# Altium schematic sheet RPi_Pico.SchDoc: Raspberry Pi Pico
size A
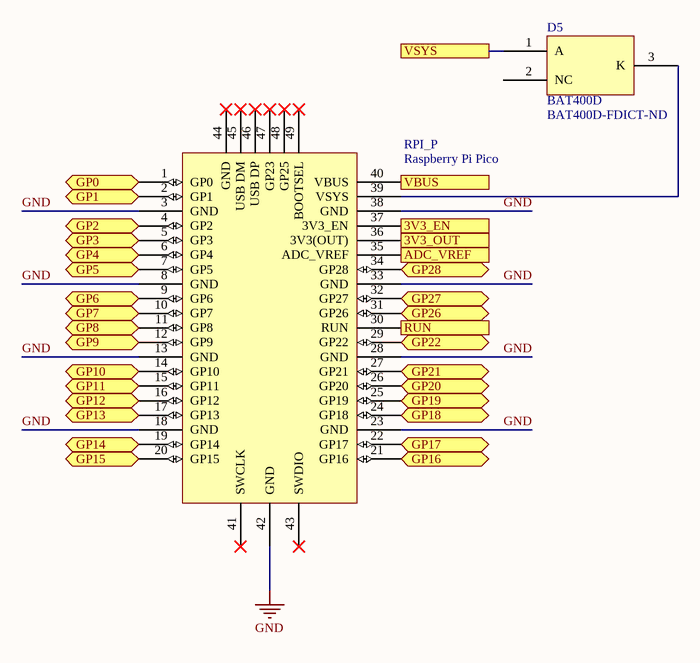
[diagram p0: RPi_Pico.SchDoc]

## Parts
D5  BAT400D  Supplier Part Number 1: BAT400D-FDICT-ND  [SOT95P236X110-3N]
RPI_P  Raspberry Pi Pico  [RPI_PICO]

## Ports
3V3_EN, 3V3_OUT, ADC_VREF (in), GP0 (bidir), GP1 (bidir), GP2 (bidir), GP3 (bidir), GP4 (bidir), GP5 (bidir), GP6 (bidir), GP7 (bidir), GP8 (bidir), GP9 (bidir), GP10 (bidir), GP11 (bidir), GP12 (bidir), GP13 (bidir), GP14 (bidir), GP15 (bidir), GP16 (bidir), GP17 (bidir), GP18 (bidir), GP19 (bidir), GP20 (bidir), GP21 (bidir), GP22 (bidir), GP26 (bidir), GP27 (bidir), GP28 (bidir), RUN (in), VBUS, VSYS

## Nets
GND: RPI_P.3(GND) RPI_P.8(GND) RPI_P.13(GND) RPI_P.18(GND) RPI_P.23(GND) RPI_P.28(GND) RPI_P.33(GND) RPI_P.38(GND) RPI_P.42(GND)
3V3_EN: RPI_P.37(3V3_EN) ; port 3V3_EN
3V3_OUT: RPI_P.36(3V3(OUT)) ; port 3V3_OUT
ADC_VREF: RPI_P.35(ADC_VREF) ; port ADC_VREF
GP0: RPI_P.1(GP0) ; port GP0
GP1: RPI_P.2(GP1) ; port GP1
GP2: RPI_P.4(GP2) ; port GP2
GP3: RPI_P.5(GP3) ; port GP3
GP4: RPI_P.6(GP4) ; port GP4
GP5: RPI_P.7(GP5) ; port GP5
GP6: RPI_P.9(GP6) ; port GP6
GP7: RPI_P.10(GP7) ; port GP7
GP8: RPI_P.11(GP8) ; port GP8
GP9: RPI_P.12(GP9) ; port GP9
GP10: RPI_P.14(GP10) ; port GP10
GP11: RPI_P.15(GP11) ; port GP11
GP12: RPI_P.16(GP12) ; port GP12
GP13: RPI_P.17(GP13) ; port GP13
GP14: RPI_P.19(GP14) ; port GP14
GP15: RPI_P.20(GP15) ; port GP15
GP16: RPI_P.21(GP16) ; port GP16
GP17: RPI_P.22(GP17) ; port GP17
GP18: RPI_P.24(GP18) ; port GP18
GP19: RPI_P.25(GP19) ; port GP19
GP20: RPI_P.26(GP20) ; port GP20
GP21: RPI_P.27(GP21) ; port GP21
GP22: RPI_P.29(GP22) ; port GP22
GP26: RPI_P.31(GP26) ; port GP26
GP27: RPI_P.32(GP27) ; port GP27
GP28: RPI_P.34(GP28) ; port GP28
RUN: RPI_P.30(RUN) ; port RUN
VBUS: RPI_P.40(VBUS) ; port VBUS
VSYS: D5.1(A) ; port VSYS
NetD5_3: D5.3(K) RPI_P.39(VSYS)

Not connected (* = marked no-connect by the designer): D5 2(NC); RPI_P 41(SWCLK)* 43(SWDIO)* 44(GND)* 45(USB_DM)* 46(USB_DP)* 47(GP23)* 48(GP25)* 49(BOOTSEL)*

## Library data of the parts
D5 = BAT400D: Supplier 1: Digi-Key